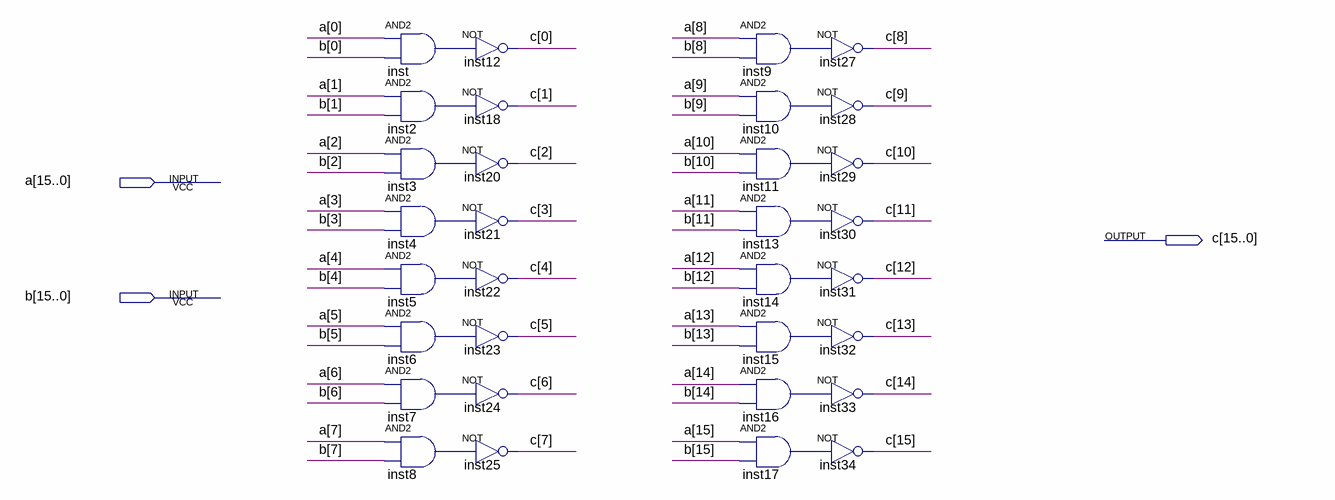
[diagram p0: schematic sheet]
// Quartus schematic Nand16.bdf as structural Verilog: 32 symbols, 3 pins
module Nand16 (
  input  [15:0] a,
  input  [15:0] b,
  output [15:0] c
);

  wire inst2_out, inst3_out, inst4_out, inst5_out, inst6_out, inst7_out, inst8_out, inst9_out, inst10_out,
       inst11_out, inst13_out, inst14_out, inst15_out, inst16_out, inst17_out, inst_out;

  and inst (inst_out, a[0], b[0]);
  and inst2 (inst2_out, a[1], b[1]);
  and inst3 (inst3_out, a[2], b[2]);
  and inst4 (inst4_out, a[3], b[3]);
  and inst5 (inst5_out, a[4], b[4]);
  and inst6 (inst6_out, a[5], b[5]);
  and inst7 (inst7_out, a[6], b[6]);
  and inst8 (inst8_out, a[7], b[7]);
  not inst12 (c[0], inst_out);
  not inst18 (c[1], inst2_out);
  not inst20 (c[2], inst3_out);
  not inst21 (c[3], inst4_out);
  not inst22 (c[4], inst5_out);
  not inst23 (c[5], inst6_out);
  not inst24 (c[6], inst7_out);
  not inst25 (c[7], inst8_out);
  and inst9 (inst9_out, a[8], b[8]);
  and inst10 (inst10_out, a[9], b[9]);
  and inst11 (inst11_out, a[10], b[10]);
  and inst13 (inst13_out, a[11], b[11]);
  and inst14 (inst14_out, a[12], b[12]);
  and inst15 (inst15_out, a[13], b[13]);
  and inst16 (inst16_out, a[14], b[14]);
  and inst17 (inst17_out, a[15], b[15]);
  not inst27 (c[8], inst9_out);
  not inst28 (c[9], inst10_out);
  not inst29 (c[10], inst11_out);
  not inst30 (c[11], inst13_out);
  not inst31 (c[12], inst14_out);
  not inst32 (c[13], inst15_out);
  not inst33 (c[14], inst16_out);
  not inst34 (c[15], inst17_out);
endmodule
